# EAGLE design SEG2 (EAGLE 9.6.2)
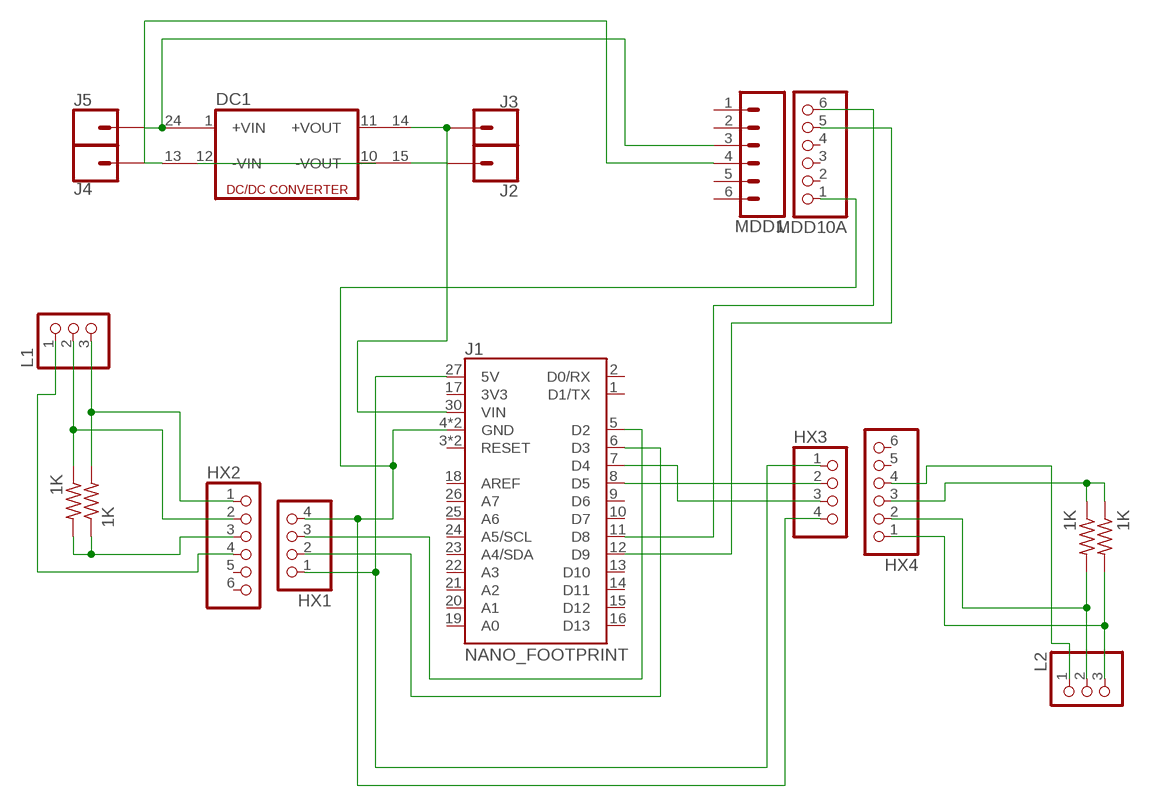
[diagram p0: schematic, sheet 1]

## Parts
DC1  DC213R  [CMK]
HX1  PINHD-1X4  [1X04]
HX2  PINHD-1X6  [1X06]
HX3  PINHD-1X4  [1X04]
HX4  PINHD-1X6  [1X06]
J1  NANO_FOOTPRINT  [NANO]
J2  CONN_01  [1X01]
J3  CONN_01  [1X01]
J4  CONN_01  [1X01]
J5  CONN_01  [1X01]
L1  PINHD-1X3  [1X03]
L2  PINHD-1X3  [1X03]
MDD1  CONN_06LOCK  [1X06_LOCK]
MDD10A  PINHD-1X6  [1X06]
R1  1K  R-US_0204/7  [0204/7]
R2  1K  R-US_0204/7  [0204/7]
R3  1K  R-US_0204/7  [0204/7]
R4  1K  R-US_0204/7  [0204/7]

## Nets
N$1: HX1.4 HX3.4 J1.4(GND) J1.29(GND) MDD10A.1
N$2: HX1.3 J1.5(D2)
N$3: HX1.2 J1.6(D3)
N$4: HX1.1 HX3.1 J1.27(5V)
N$5: HX2.3 R1.1 R2.2
N$6: HX3.3 J1.7(D4)
N$7: HX3.2 J1.8(D5)
N$8: HX2.2 L1.2 R2.1
N$9: HX2.4 L1.1
N$10: HX2.1 L1.3 R1.2
N$11: HX4.1 L2.3 R3.2
N$12: HX4.2 L2.2 R4.2
N$13: DC1.24(+VIN1) J4.1 MDD1.3
N$14: HX4.3 R3.1 R4.1
N$16: HX4.4 L2.1
N$17: DC1.14(+VOUT1) J1.30(VIN) J2.1
N$19: DC1.10(-VOUT) DC1.12(-VIN)
N$20: DC1.13(-VIN1) J5.1 MDD1.4
N$21: DC1.15(-VOUT1) J3.1
N$22: J1.11(D8) MDD10A.6
N$23: J1.12(D9) MDD10A.5
Unconnected: DC1.1(+VIN) DC1.11(+VOUT) HX2.5 HX2.6 HX4.5 HX4.6 J1.1(D1/TX) J1.2(D0/RX) J1.3(RESET) J1.9(D6) J1.10(D7) J1.13(D10) J1.14(D11) J1.15(D12) J1.16(D13) J1.17(3V3) J1.18(AREF) J1.19(A0) J1.20(A1) J1.21(A2) J1.22(A3) J1.23(A4/SDA) J1.24(A5/SCL) J1.25(A6) J1.26(A7) J1.28(RESET) MDD1.1 MDD1.2 MDD1.5 MDD1.6 MDD10A.2 MDD10A.3 MDD10A.4

## Library data of the parts
DC1 = dc-dc-converter:DC213R: DC-DC CONVERTER; OC_FARNELL: unknown; OC_NEWARK: unknown
HX1 HX3 = pinhead:PINHD-1X4: PIN HEADER
HX2 HX4 MDD10A = pinhead:PINHD-1X6: PIN HEADER
J1 = SparkFun-Boards:NANO_FOOTPRINT: Generic Nano Footprint
J2-J5 = SparkFun-Connectors:CONN_01: Single connection point. Often used as Generic Header-pin footprint for 0.1 inch spaced/style header connections On any of the 0.1 inch spaced packages, you can populate with these: Break Away Headers - Straight <https://www.sparkfun.com/products/116> (PRT-00116) Break Away Male Headers - Right Angle <https://www.sparkfun.com/products/553> (PRT-00553) Female Headers <https://www.sparkfun.com/products/115> (PRT-00115) Break Away Headers - Machine Pin <https://www.sparkfun.com/products/117> (PRT-00117) Break Away Female Headers - Swiss Machine Pin <https://www.sparkfun.com/products/743> (PRT-00743) This device is also useful as a general connection point to wire up your design to another part of your project. Our various solder wires solder well into these plated through hole pads. Hook-Up Wire - Assortment (Stranded, 22 AWG) <https://www.sparkfun.com/products/11375> (PRT-11375) Hook-Up Wire - Assortment (Solid Core, 22 AWG) <https://www.sparkfun.com/products/11367> (PRT-11367) View the entire wire category on our website here <https://www.sparkfun.com/categories/141> Special notes: SMTSO-256-ET is a "flush mount" nut for a 4-40 screw. We mostly use this on specialty testbeds; it is a nice way to connect hardware to your PCB at an adjustable hieght. Also note, the SNAP packages are for using a snappable style connector. We sell a baggie of snaps and they are also used on two LilyPad designs: Snap Assortment - 30 pack (male and female) <https://www.sparkfun.com/products/11347> (DEV-11347) LilyPad Arduino SimpleSnap <https://www.sparkfun.com/products/10941> (DEV-10941) LilyPad SimpleSnap Protoboard <https://www.sparkfun.com/products/10940> (DEV-10940)
L1 L2 = pinhead:PINHD-1X3: PIN HEADER
MDD1 = SparkFun-Connectors:CONN_06: Multi connection point. Often used as Generic Header-pin footprint for 0.1 inch spaced/style header connections On any of the 0.1 inch spaced packages, you can populate with these: Break Away Headers - Straight <https://www.sparkfun.com/products/116> (PRT-00116) Break Away Male Headers - Right Angle <https://www.sparkfun.com/products/553> (PRT-00553) Female Headers <https://www.sparkfun.com/products/115> (PRT-00115) Break Away Headers - Machine Pin <https://www.sparkfun.com/products/117> (PRT-00117) Break Away Female Headers - Swiss Machine Pin <https://www.sparkfun.com/products/743> (PRT-00743) Arduino Stackable Header - 6 Pin <https://www.sparkfun.com/products/9280> (PRT-09280) For SCREWTERMINALS and SPRING TERMINALS visit here: Screw Terimnals on SparkFun.com <https://www.sparkfun.com/search/results?term=Screw+Terminals> (5mm/3.5mm/2.54mm spacing) This device is also useful as a general connection point to wire up your design to another part of your project. Our various solder wires solder well into these plated through hole pads. Hook-Up Wire - Assortment (Stranded, 22 AWG) <https://www.sparkfun.com/products/11375> (PRT-11375) Hook-Up Wire - Assortment (Solid Core, 22 AWG) <https://www.sparkfun.com/products/11367> (PRT-11367) View the entire wire category on our website here <https://www.sparkfun.com/categories/141>
R1-R4 = rcl:R-US_: RESISTOR, American symbol; SPICEPREFIX: R

## Board
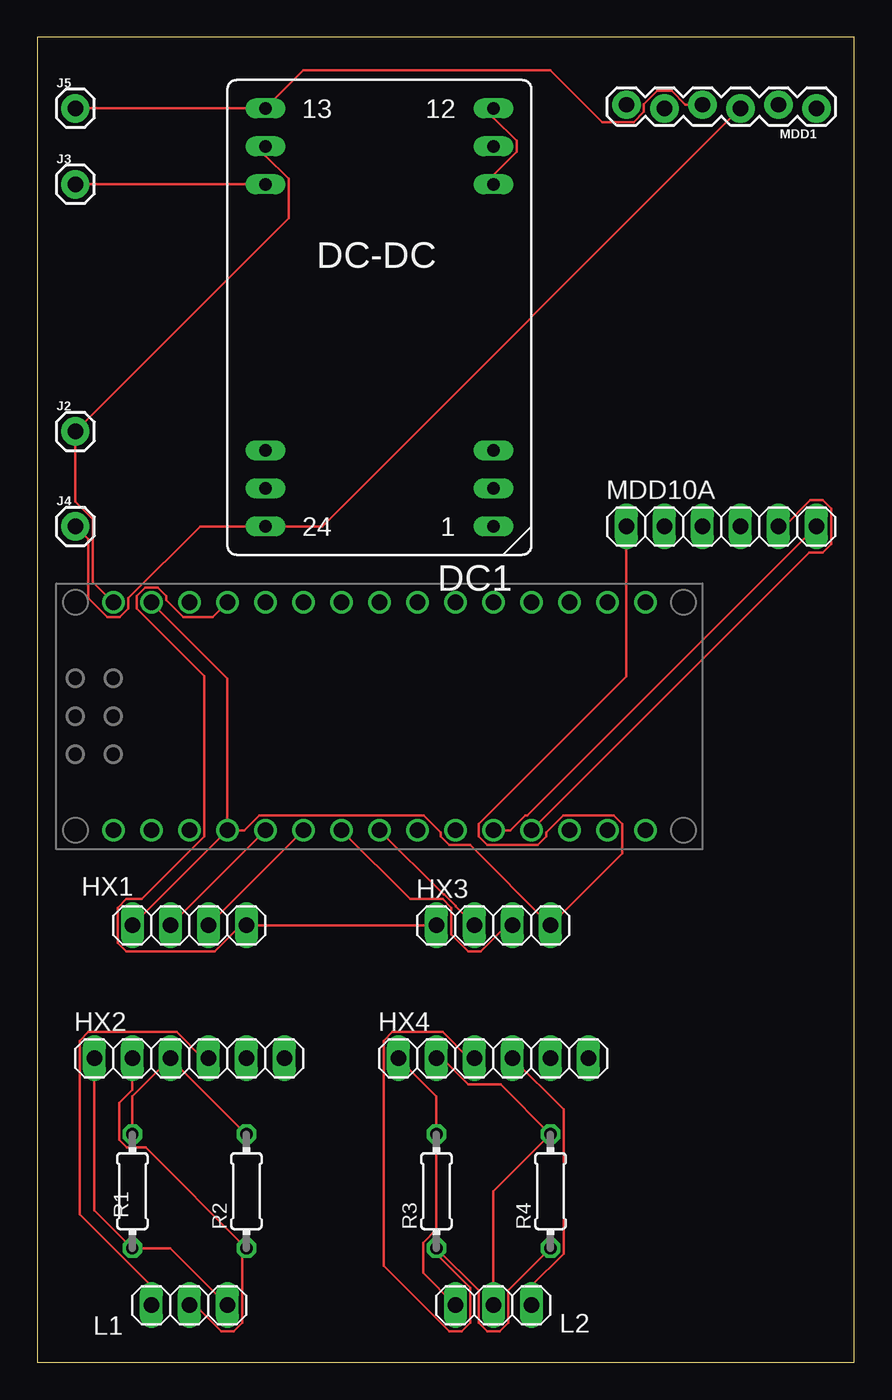
[diagram p1: board, top side]

Size 54.59 x 88.57 mm. Coordinates in mm from the lower left corner, seen from the top.
Outline: 0,0 54.59,0 54.59,88.57 0,88.57 0,0
Copper layers (1*16): Top 0.035mm / dielectric 1.5mm / Bottom 0.035mm
Design rules "default": minimum track width 6mil, minimum drill 0.35mm, track to track 6mil, track to pad 6mil, pad to pad 6mil, via to via 6mil, smd to smd 6mil, copper to edge 40mil, drill to drill 6mil, minimum pad ring 10mil, minimum via ring 8mil, stop-mask expansion 4mil, vias tented up to drill 0mil, thermal gap 10mil

### Footprints (pad centres in the part's own frame; a part is rotated, then mirrored left to right if it is on the bottom)
CMK = drill 0.813 long: 1 -7.62,13.97; 2 -7.62,11.43; 3 -7.62,8.89; 10 -7.62,-8.89; 11 -7.62,-11.43; 12 -7.62,-13.97; 13 7.62,-13.97; 14 7.62,-11.43; 15 7.62,-8.89; 22 7.62,8.89; 23 7.62,11.43; 24 7.62,13.97
1X04 = drill 1.016 long: 1 -3.81,0; 2 -1.27,0; 3 1.27,0; 4 3.81,0
1X06 = drill 1.016 long: 1 -6.35,0; 2 -3.81,0; 3 -1.27,0; 4 1.27,0; 5 3.81,0; 6 6.35,0
NANO = drill 1.016: 1 -7.62,17.78; 2 -7.62,15.24; 3 -7.62,12.7; 4 -7.62,10.16; 5 -7.62,7.62; 6 -7.62,5.08; 7 -7.62,2.54; 8 -7.62,0; 9 -7.62,-2.54; 10 -7.62,-5.08; 11 -7.62,-7.62; 12 -7.62,-10.16; 13 -7.62,-12.7; 14 -7.62,-15.24; 15 -7.62,-17.78; 16 7.62,-17.78; 17 7.62,-15.24; 18 7.62,-12.7; 19 7.62,-10.16; 20 7.62,-7.62; 21 7.62,-5.08; 22 7.62,-2.54; 23 7.62,0; 24 7.62,2.54; 25 7.62,5.08; 26 7.62,7.62; 27 7.62,10.16; 28 7.62,12.7; 29 7.62,15.24; 30 7.62,17.78
1X01 = drill 1.016 pad 1.88: 1 0,0
1X03 = drill 1.016 long: 1 -2.54,0; 2 0,0; 3 2.54,0
1X06_LOCK = drill 1.016 pad 1.88: 1 0,0; 2 2.54,-0.254; 3 5.08,0; 4 7.62,-0.254; 5 10.16,0; 6 12.7,-0.254
0204/7 = drill 0.813 octagon: 1 -3.81,0; 2 3.81,0

### Placement (x,y rotation side)
DC1  22.86,69.85 180 top
HX1  10.16,29.21 180 top
HX2  10.16,20.32 0 top
HX3  30.48,29.21 0 top
HX4  30.48,20.32 0 top
J1  22.86,43.18 90 top
J2  2.54,62.23 0 top
J3  2.54,78.74 0 top
J4  2.54,55.88 0 top
J5  2.54,83.82 0 top
L1  10.16,3.81 0 top
L2  30.48,3.81 180 top
MDD1  52.07,83.82 180 top
MDD10A  45.72,55.88 0 top
R1  6.35,11.43 270 top
R2  13.97,11.43 90 top
R3  26.67,11.43 90 top
R4  34.29,11.43 90 top

### Tracks (layer width: path | path; a pad name or v marks a point on that pad's centre or on a via)
N$1
  Top 0.152: MDD10A.1 39.37,45.85 29.49,35.97 29.49,35.15 30.07,34.57 33.43,34.57 34.01,35.15 34.01,35.41 35.15,36.55 38.51,36.55 39.09,35.97 39.09,34.01 HX3.4 28.93,34.57 27.53,34.57 26.95,35.15 26.95,35.41 25.81,36.55 14.83,36.55 13.84,35.56 J1.4 | J1.29 12.7,45.72 J1.4 | J1.4 HX1.4
N$2
  Top 0.152: HX1.3 J1.5
N$3
  Top 0.152: HX1.2 J1.6
N$4
  Top 0.152: HX3.1 HX1.1 13.59,29.21 11.84,27.46 5.94,27.46 5.36,28.04 5.36,30.38 5.94,30.96 6.96,30.96 11.15,35.15 11.15,45.87 6.63,50.39 6.63,51.21 7.21,51.79 8.03,51.79 8.61,51.21 8.61,50.95 9.75,49.81 11.71,49.81 J1.27
N$5
  Top 0.152: R2.2 HX2.3 6.35,17.78 R1.1
N$6
  Top 0.152: HX3.3 31.37,29.21 29.62,27.46 28.8,27.46 27.66,28.6 27.66,30.38 27.08,30.96 24.92,30.96 J1.7
N$7
  Top 0.152: J1.8 27.15,31.27 27.21,31.27 27.96,30.51 27.96,30.45 HX3.2
N$8
  Top 0.152: L1.2 10.54,3.81 12.29,2.06 13.11,2.06 13.69,2.64 13.69,7.34 R2.1 7.24,14.35 5.98,14.35 5.46,14.87 5.46,17.32 6.35,18.21 HX2.2
N$9
  Top 0.152: L1.1 7.62,5.09 2.82,9.89 2.82,21.49 3.4,22.07 9.3,22.07 11.05,20.32 HX2.4
N$10
  Top 0.152: HX2.1 3.81,10.16 R1.2 8.89,7.62 L1.3
N$11
  Top 0.152: HX4.1 26.67,17.78 R3.2 26.67,8.88 25.78,7.99 25.78,5.97 L2.3
N$12
  Top 0.152: HX4.2 27.05,20.32 28.8,18.57 30.96,18.57 R4.2 30.48,11.43 L2.2
N$13
  Top 0.152: MDD1.3 19.05,55.88 DC1.24 10.87,55.88 6.07,51.08 6.07,50.39 5.49,49.81 4.67,49.81 3.4,51.08 3.4,55.02 J4.1
N$14
  Top 0.152: R4.1 31.47,4.8 31.47,2.64 30.89,2.06 30.07,2.06 29.49,2.64 29.49,4.8 R3.1 26.67,7.24 28.93,4.98 28.93,2.64 28.35,2.06 27.53,2.06 23.14,6.45 23.14,21.49 23.72,22.07 27.08,22.07 28.83,20.32 HX4.3
N$16
  Top 0.152: L2.1 33.02,5.09 35.18,7.25 35.18,16.89 HX4.4
N$17
  Top 0.152: DC1.14 15.24,80.66 16.79,79.11 16.79,76.48 J2.1 2.54,57.53 3.71,56.36 3.71,52.17 J1.30
N$19
  Top 0.152: DC1.12 30.48,83.2 32.03,81.65 32.03,80.91 30.48,79.36 DC1.10
N$20
  Top 0.152: J5.1 DC1.13 17.78,86.36 34.29,86.36 37.74,82.91 39.85,82.91 40.54,83.59 40.54,84.1 41.43,84.99 42.39,84.99 43.31,84.07 MDD1.4
N$21
  Top 0.152: DC1.15 J3.1
N$22
  Top 0.152: MDD10A.6 32.74,36.55 32.61,36.55 31.62,35.56 J1.11
N$23
  Top 0.152: MDD10A.5 49.91,55.88 51.66,57.63 52.48,57.63 53.06,57.05 53.06,54.71 52.48,54.13 51.59,54.13 J1.12